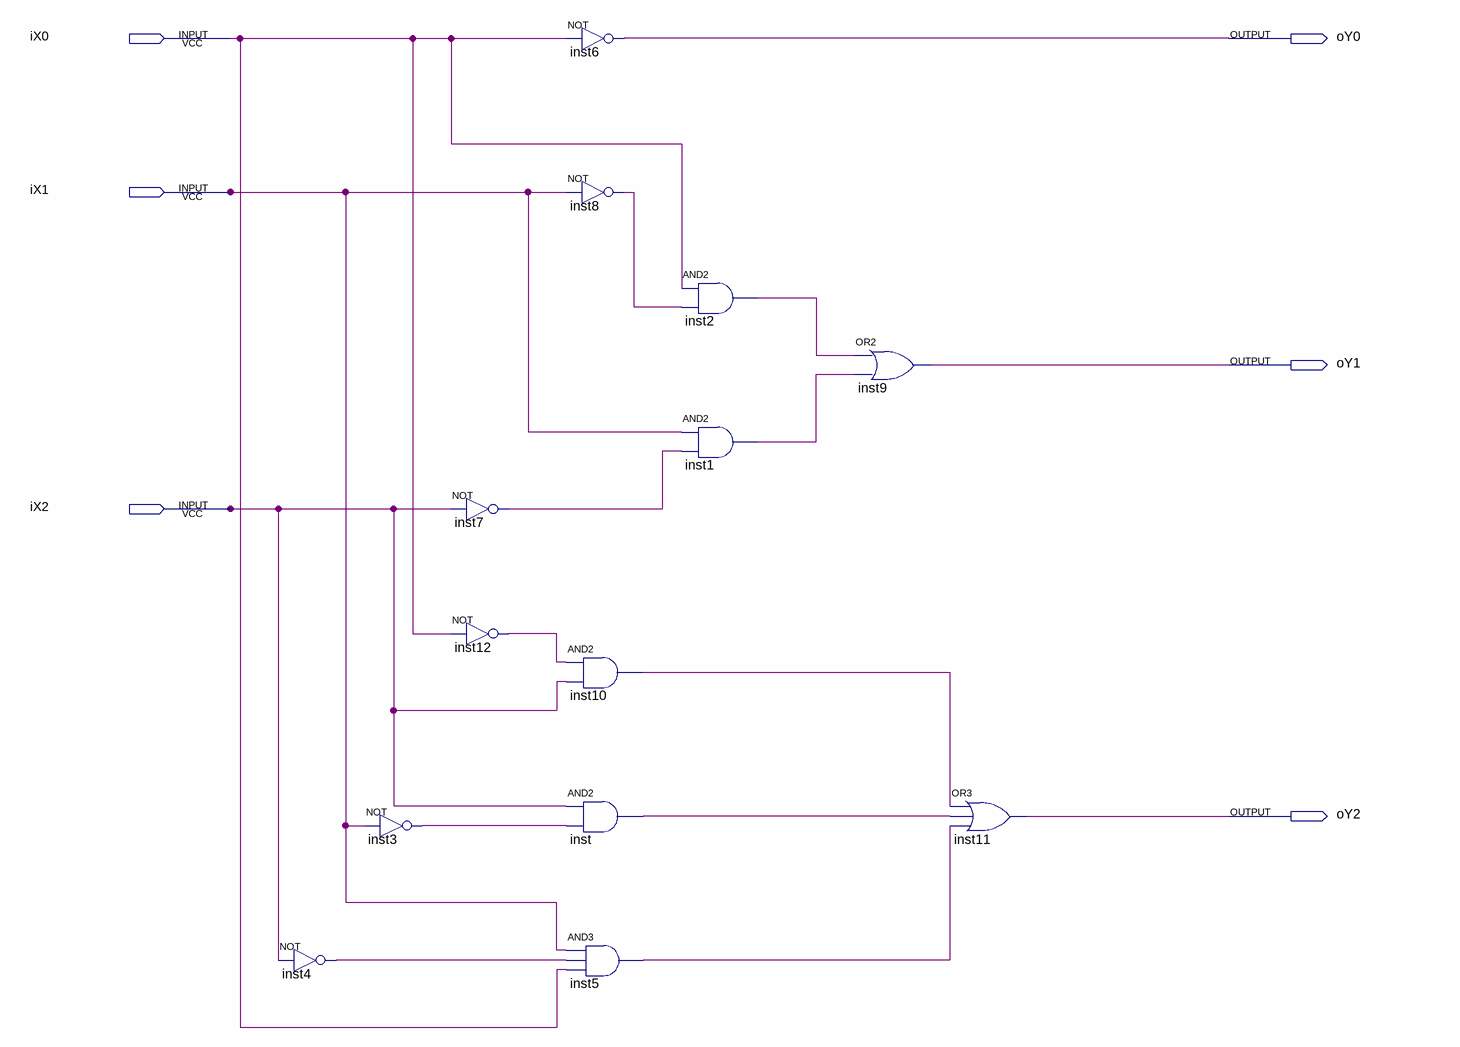
[diagram p0: schematic sheet]
// Quartus schematic MySecondDigitalSystem.bdf as structural Verilog: 13 symbols, 6 pins
module MySecondDigitalSystem (
  input  iX0,
  input  iX1,
  input  iX2,
  output oY0,
  output oY1,
  output oY2
);

  wire inst1_out, inst2_out, inst3_out, inst4_out, inst5_out, inst7_out, inst8_out, inst10_out, inst12_out,
       inst_out;

  not inst4 (inst4_out, iX2);
  not inst3 (inst3_out, iX1);
  not inst7 (inst7_out, iX2);
  not inst12 (inst12_out, iX0);
  not inst6 (oY0, iX0);
  not inst8 (inst8_out, iX1);
  and inst10 (inst10_out, inst12_out, iX2);
  and inst (inst_out, iX2, inst3_out);
  and inst5 (inst5_out, iX1, inst4_out, iX0);
  and inst2 (inst2_out, iX0, inst8_out);
  and inst1 (inst1_out, iX1, inst7_out);
  or inst9 (oY1, inst2_out, inst1_out);
  or inst11 (oY2, inst10_out, inst_out, inst5_out);
endmodule
